# EAGLE design SilentStepStick-TMC2100_v13 (EAGLE 7.7.0)
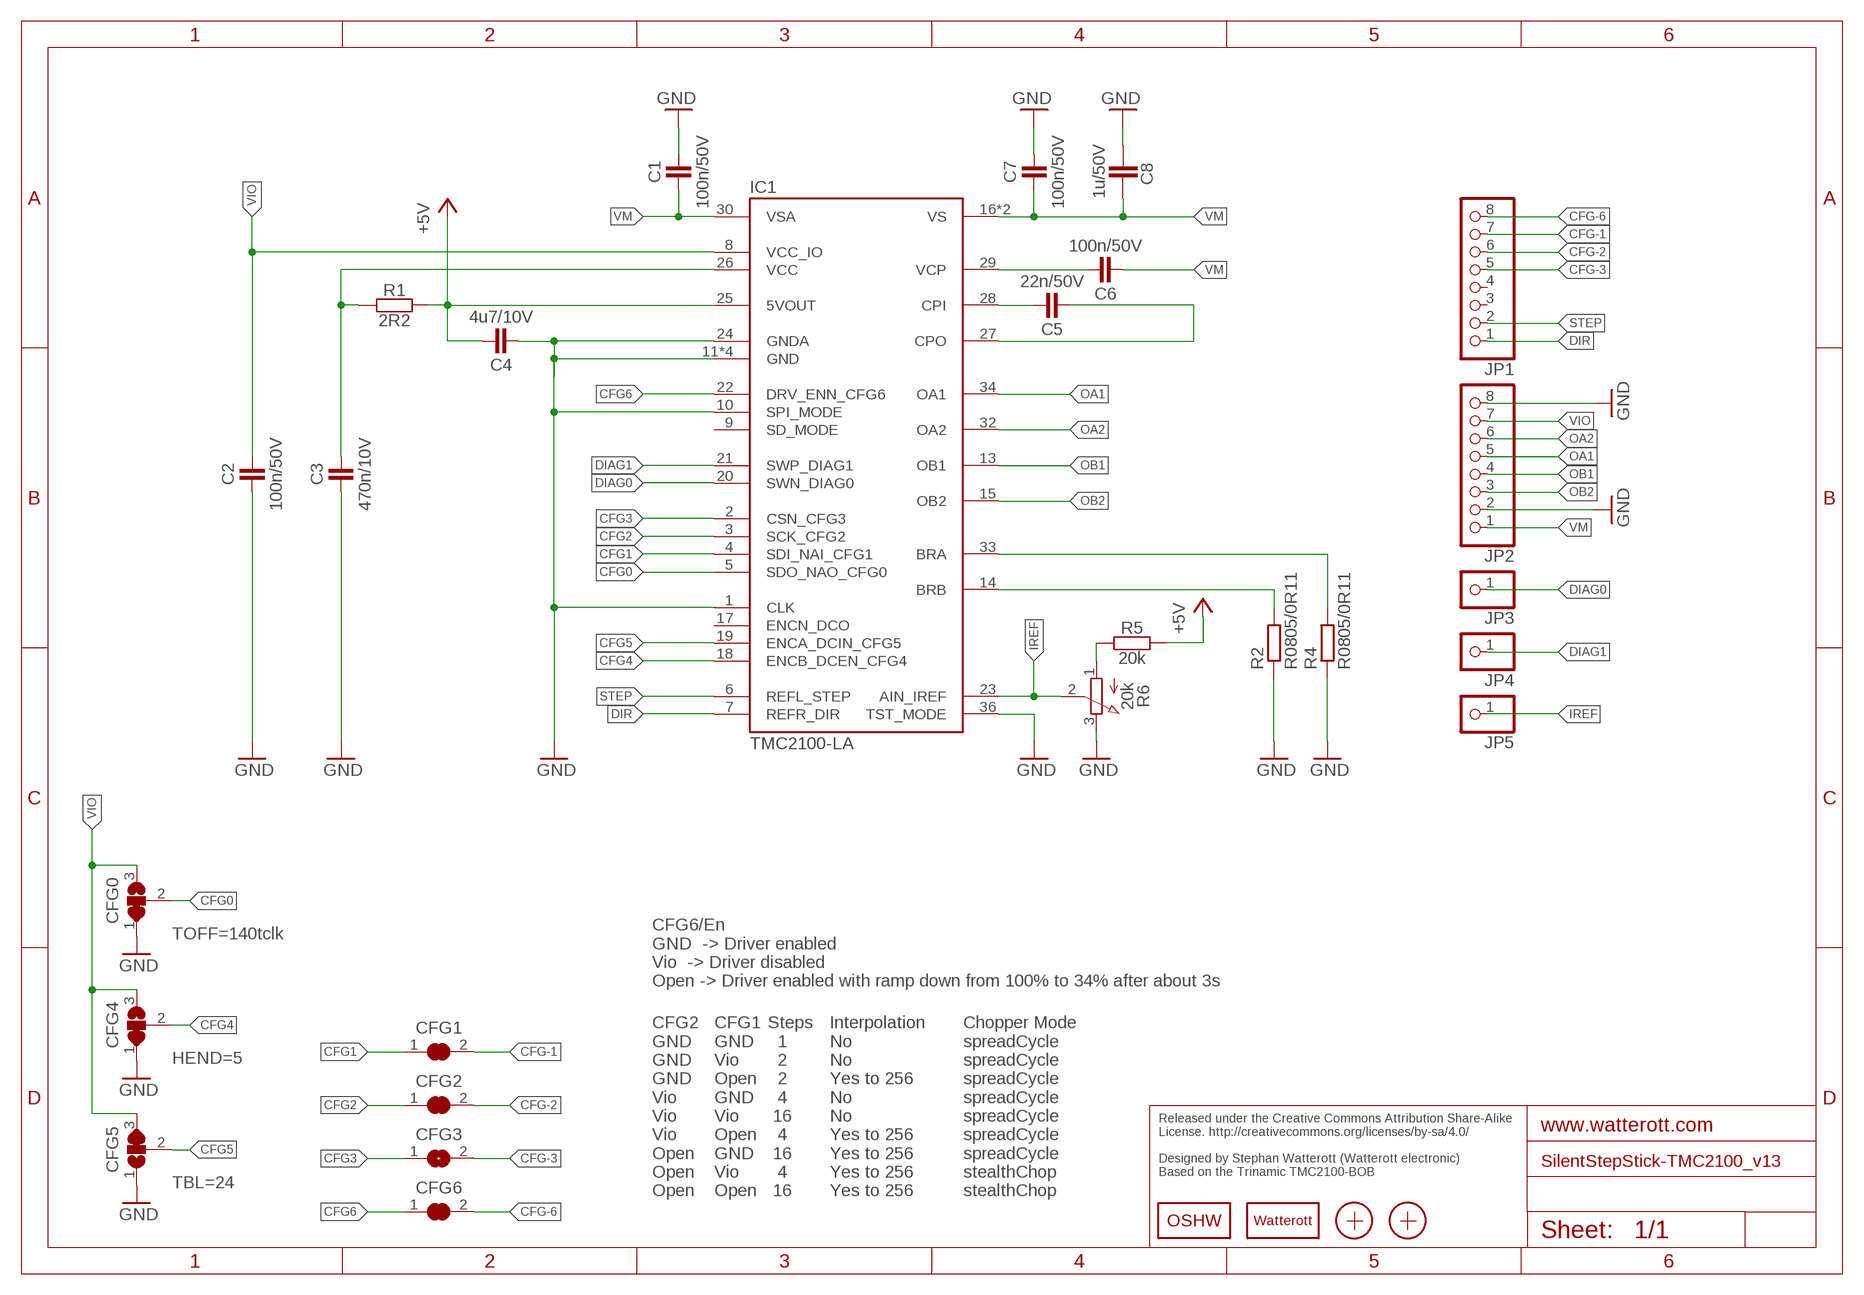
[diagram p0: schematic, sheet 1]

## Parts
C1  100n/50V  CAPACITOR-0402  [C0402]
C2  100n/50V  CAPACITOR-0402  [C0402]
C3  470n/10V  CAPACITOR-0402  [C0402]
C4  4u7/10V  CAPACITOR-0402  [C0402]
C5  22n/50V  CAPACITOR-0402  [C0402]
C6  100n/50V  CAPACITOR-0402  [C0402]
C7  100n/50V  CAPACITOR-0402  [C0402]
C8  1u/50V  C-EUC0603  [C0603]
CFG0  JUMPER3-0201  [JUMPER3-0201]
CFG1  JUMPER2-0201  [JUMPER2-0201]
CFG2  JUMPER2-0201  [JUMPER2-0201]
CFG3  JUMPER2-0201  [JUMPER2-0201]
CFG4  JUMPER3-0201  [JUMPER3-0201]
CFG5  JUMPER3-0201  [JUMPER3-0201]
CFG6  JUMPER2-0201  [JUMPER2-0201]
IC1  TMC2100-LA  TMC21X0-LA  [QFN36-PAD]
JP1  PINHD-1X08_2.54-S  [1X08-S]
JP2  PINHD-1X08_2.54-S  [1X08-S]
JP3  PINHD-1X1  [1X01]
JP4  PINHD-1X1  [1X01]
JP5  PINHD-1X1  [1X01]
LOGO1  OSHW_LOGOX0070  [OSHW_6X70]
LOGO2  LOGO-S_PLACE_M  [SPARK_TPLACE_M]
R1  2R2  RESISTOR-0402  [C0402]
R2  R0805/0R11  R-EU_M0805  [M0805]
R4  R0805/0R11  R-EU_M0805  [M0805]
R5  20k  RESISTOR-0402  [C0402]
R6  20k  POT-EVM3R  [POT_EVM3R]
X1  PASSER-07  [PASSER_07MM]
X2  PASSER-07  [PASSER_07MM]

## Nets
+5V: C4.2 IC1.25(5VOUT) R1.2 R5.2
BRA: IC1.33(BRA) R4.2
BRB: IC1.14(BRB) R2.2
CFG0: CFG0.2 IC1.5(SDO_NAO_CFG0)
CFG1: CFG1.1 IC1.4(SDI_NAI_CFG1)
CFG2: CFG2.1 IC1.3(SCK_CFG2)
CFG3: CFG3.1 IC1.2(CSN_CFG3)
CFG4: CFG4.2 IC1.18(ENCB_DCEN_CFG4)
CFG5: CFG5.2 IC1.19(ENCA_DCIN_CFG5)
CFG6: CFG6.1 IC1.22(DRV_ENN_CFG6)
CFG-1: CFG1.2 JP1.7
CFG-2: CFG2.2 JP1.6
CFG-3: CFG3.2 JP1.5
CFG-6: CFG6.2 JP1.8
CPI: C5.2 IC1.28(CPI)
CPO: C5.1 IC1.27(CPO)
DIAG0: IC1.20(SWN_DIAG0) JP3.1
DIAG1: IC1.21(SWP_DIAG1) JP4.1
DIR: IC1.7(REFR_DIR) JP1.1
GND: C1.2 C2.1 C3.1 C4.1 C7.2 C8.2 CFG0.1 CFG4.1 CFG5.1 IC1.1(CLK) IC1.10(SPI_MODE) IC1.11(GND) IC1.12(GND) IC1.24(GNDA) IC1.35(GND) IC1.36(TST_MODE) IC1.TP(GND) JP2.2 JP2.8 R2.1 R4.1 R6.3(E)
IREF: IC1.23(AIN_IREF) JP5.1 R6.2(S)
OA1: IC1.34(OA1) JP2.5
OA2: IC1.32(OA2) JP2.6
OB1: IC1.13(OB1) JP2.4
OB2: IC1.15(OB2) JP2.3
STEP: IC1.6(REFL_STEP) JP1.2
VCC: C3.2 IC1.26(VCC) R1.1
VCP: C6.2 IC1.29(VCP)
VIO: C2.2 CFG0.3 CFG4.3 CFG5.3 IC1.8(VCC_IO) JP2.7
VM: C1.1 C6.1 C7.1 C8.1 IC1.16(VS) IC1.30(VSA) IC1.31(VS) JP2.1
VREF1: R5.1 R6.1(A)
Unconnected: IC1.9(SD_MODE) IC1.17(ENCN_DCO) JP1.3 JP1.4

## Notes on the sheet
- CFG6/En
  GND  -> Driver enabled
  Vio  -> Driver disabled
  Open -> Driver enabled with ramp down from 100% to 34% after about 3s
- TOFF=140tclk
- CFG2
  GND
  GND
  GND
  Vio
  Vio
  Vio
  Open
  Open
  Open
- CFG1
  GND
  Vio
  Open
  GND
  Vio
  Open
  GND
  Vio
  Open
- Steps
    1
    2
    2
    4
   16
    4
   16
    4
   16
- Interpolation
  No
  No
  Yes to 256
  No
  No
  Yes to 256
  Yes to 256
  Yes to 256
  Yes to 256
- Chopper Mode
  spreadCycle
  spreadCycle
  spreadCycle
  spreadCycle
  spreadCycle
  spreadCycle
  spreadCycle
  stealthChop
  stealthChop
- HEND=5
- Released under the Creative Commons Attribution Share-Alike 
  License. http://creativecommons.org/licenses/by-sa/4.0/
  
  Designed by Stephan Watterott (Watterott electronic) 
  Based on the Trinamic TMC2100-BOB
- TBL=24

## Library data of the parts
C1-C7 = we-rcl:CAPACITOR: Capacitors ...2.2uF @ 6.3V -> 0402 ...4.7uF @ 6.3V -> 0603 ...10uF @ 16V -> 0805 ...22uF @ 25V -> 1206
C8 = rcl:C-EU: CAPACITOR, European symbol
CFG0 CFG4 CFG5 = we-rcl:JUMPER3: 3 Pin Jumpers
CFG1-CFG3 CFG6 = we-rcl:JUMPER2: 2 Pin Jumpers
IC1 = we-chip:TMC21X0: Trinamic TMC21x0 Stepper Motor Driver (5V...46V, 1.2A RMS, 256 microsteps) TMC2100 - CFG pins for configuration (standalone) TMC2130 - SPI for configuration
JP1 JP2 = pinhead-2:PINHD-1X08: PIN HEADER
JP3-JP5 = pinhead:PINHD-1X1: PIN HEADER
LOGO1 = we-symbol:OSHW_LOGO: Open-Source-Hardware Logo
LOGO2 = we-symbol:LOGO: Watterott electronic Logo
R1 R5 = we-rcl:RESISTOR: Resistors all kinds in 0402 and 0603
R2 R4 = rcl:R-EU_: RESISTOR, European symbol
R6 = we-rcl:POT: Potentiometer
X1 X2 = we-symbol:PASSER: Fiducial Markers

## Board
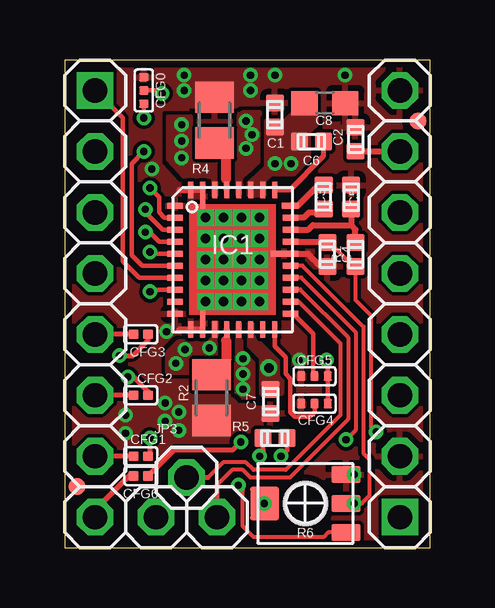
[diagram p1: board, top side]
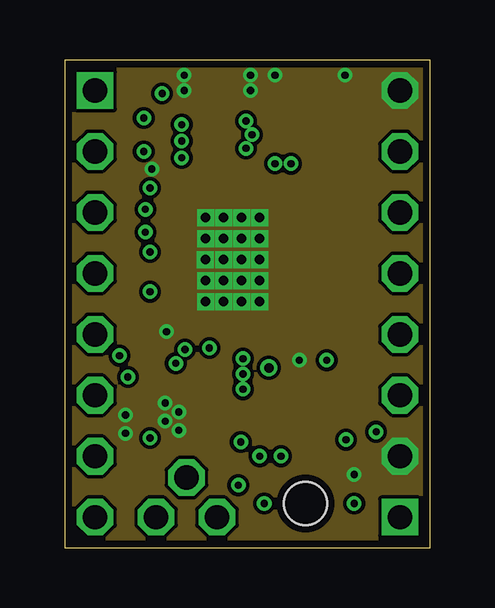
[diagram p2: board, inner layer Ground]
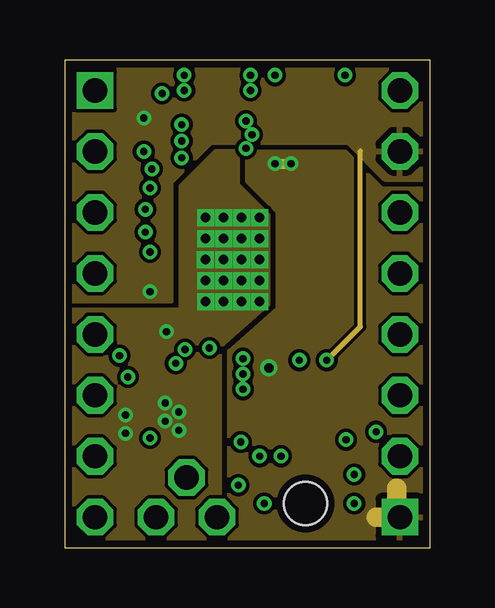
[diagram p3: board, inner layer Supply]
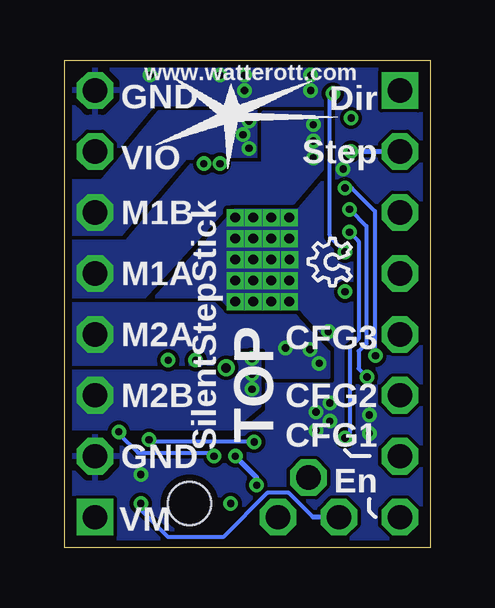
[diagram p4: board, bottom side, seen from below]

Size 15.24 x 20.32 mm. Coordinates in mm from the lower left corner, seen from the top.
Outline: 0,0 15.24,0 15.24,20.32 0,20.32 0,0
Copper layers (1+2*15+16): Top 0.035mm / dielectric 0.35mm / Ground 0.035mm / dielectric 0.76mm / Supply 0.035mm / dielectric 0.35mm / Bottom 0.035mm
Design rules "Default_WE_Euro *": minimum track width 0.15mm, minimum drill 0.25mm, track to track 0.15mm, track to pad 0.15mm, pad to pad 0.15mm, via to via 0.15mm, smd to smd 0mil, copper to edge 0.3mm, drill to drill 8mil, minimum pad ring 10mil, minimum via ring 6mil, stop-mask expansion 2mil, vias tented up to drill 0.5mm, thermal gap 10mil

### Footprints (pad centres in the part's own frame; a part is rotated, then mirrored left to right if it is on the bottom)
C0402 = smd 0.75 x 0.7: 1 0,0.5; 2 0,-0.5
C0603 = smd 1.1 x 1: 1 -0.85,0; 2 0.85,0
JUMPER3-0201 = smd 0.4 x 0.35: 1 0,0.55; 2 0,0; 3 0,-0.55
JUMPER2-0201 = smd 0.4 x 0.4: 1 0,0.3; 2 0,-0.3
QFN36-PAD = smd 0.7 x 0.26: 1 -2.4,2.25; 2 -2.4,1.75; 3 -2.4,1.25; 4 -2.4,0.75; 5 -2.4,0.25; 6 -2.4,-0.25; 7 -2.4,-0.75; 8 -2.4,-1.25; 9 -2.4,-1.75; 10 -2.4,-2.25; 19 2.4,-2.25; 20 2.4,-1.75; 21 2.4,-1.25; 22 2.4,-0.75; 23 2.4,-0.25; 25 2.4,0.75; 26 2.4,1.25; 27 2.4,1.75; 28 2.4,2.25 | smd 0.26 x 0.7: 11 -1.75,-2.9; 13 -0.75,-2.9; 14 -0.25,-2.9; 15 0.25,-2.9; 16 0.75,-2.9; 17 1.25,-2.9; 18 1.75,-2.9; 29 1.75,2.9; 30 1.25,2.9; 31 0.75,2.9; 32 0.25,2.9; 33 -0.25,2.9; 34 -0.75,2.9; 36 -1.75,2.9 | smd 0.26 x 1.2: 12 -1.25,-2.65; 35 -1.25,2.65 | smd 1.2 x 0.26: 24 2.15,0.25 | smd 0.6 x 0.6: TP 0,0
1X08-S = drill 1.016 square: 1 -8.89,0 | drill 1.016 octagon: 2 -6.35,0; 3 -3.81,0; 4 -1.27,0; 5 1.27,0; 6 3.81,0; 7 6.35,0; 8 8.89,0
1X01 = drill 1.016 octagon: 1 0,0
M0805 = smd 1.3 x 1.6: 1 -0.95,0; 2 0.95,0
POT_EVM3R = smd 0.7 x 1.2: 1 -1.2,-1.7; 2 0,-1.7; 3 1.2,-1.7 | smd 1.4 x 1.2: MOUNT 0,1.7 | hole 1.8: 0,0
PASSER_07MM = smd 0.7 x 0.7: X 0,0

### Placement (x,y rotation side)
C1  8.76,18.03 180 top
C2  12.12,17.02 0 top
C3  11.94,14.61 0 top
C4  10.95,12.22 180 top
C5  10.79,14.61 180 top
C6  10.29,16.92 90 top
C7  8.57,6.1 0 top
C8  10.84,18.53 0 top
CFG0  3.3,19.05 0 top
CFG1  3.17,3.81 270 top
CFG2  3.17,6.35 270 top
CFG3  3.17,8.89 270 top
CFG4  10.41,6 90 top
CFG5  10.41,7.14 90 top
CFG6  3.17,2.98 270 top
IC1  7,12 0 top
JP1  1.27,10.16 270 top
JP2  13.97,10.16 90 top
JP3  5.08,2.92 0 top
JP4  6.35,1.27 0 top
JP5  3.81,1.27 0 top
LOGO1  3.3,10.92 90 bottom
LOGO2  8.26,18.03 0 bottom
R1  12.12,12.22 0 top
R2  6.12,6.25 90 top
R4  6.25,17.81 270 top
R5  8.76,4.57 90 top
R6  10.03,1.84 90 top
X1  0.51,2.54 0 top
X2  14.73,17.78 0 top

### Tracks (layer width: path | path; a pad name or v marks a point on that pad's centre or on a via)
+5V  (via drill 0.3 pad 0.41)
  Top 0.16: v12.98,4.83 12.78,5.03 12.78,9.67 12.12,10.33 R1.2 12.03,11.72 11.05,12.7 10.98,12.7 C4.2
  Top 0.2: R5.2 9.26,4.06 v9.02,3.81
  Top 0.25: IC1.25 10.93,12.75 C4.2
  Bottom 0.16: v9.02,3.81 9.08,3.87 9.1,3.87 9.17,3.95 12.18,3.95 12.98,4.75 v12.98,4.83
BRA
  Top 0.254: 6.5,16.61 R4.2 | IC1.33 6.75,15.34 6.73,15.37
  Top 0.406: 6.73,15.37 6.73,16.38 R4.2
BRB
  Top 0.16: 6.73,7.81 R2.2
  Top 0.254: IC1.14 6.75,8.66 6.73,8.64
  Top 0.406: 6.73,8.64 6.73,7.81
CFG0  (via drill 0.3)
  Top 0.18: v4.06,18.92 3.94,19.05 CFG0.2 | IC1.5 3.62,12.25 v3.56,12.32
  Bottom 0.16: 4.19,13.02 4.19,18.8 v4.06,18.92
  Bottom 0.17: 4.19,13.02 4.19,12.95 v3.56,12.32
CFG1  (via drill 0.3)
  Top 0.18: IC1.4 3.95,12.75 3.56,13.14 v3.37,13.14 | 3.56,3.89 CFG1.1
  Top 0.2: v3.56,4.57 3.56,3.89
  Bottom 0.16: v3.56,4.57 3.37,4.76 3.37,8.32 2.98,8.7 2.98,12.76 v3.37,13.14
CFG2  (via drill 0.3)
  Top 0.18: IC1.3 4.08,13.25 3.37,13.97 v3.37,14.1
  Top 0.2: CFG2.1 3.48,6.53 2.89,7.11 v2.64,7.11
  Bottom 0.16: v2.64,7.11 v2.63,7.11 2.99,7.46 2.99,8.19 2.67,8.51 2.67,13.4 v3.37,14.1
CFG3  (via drill 0.3)
  Top 0.18: IC1.2 4.16,13.75 3.94,13.97 3.94,14.61 v3.56,14.99
  Top 0.2: v2.29,8 2.86,8 3.48,8.62 CFG3.1
  Bottom 0.16: v2.29,8 2.29,8.04 2.31,8.06 2.31,14.03 3.27,14.99 v3.56,14.99
CFG4
  Top 0.18: IC1.18 8.75,8.39 9.21,7.94 9.21,7.24 9.4,7.05 9.4,5.65 9.59,5.46 10.22,5.46 10.41,5.65 CFG4.2
CFG5
  Top 0.18: IC1.19 9.55,9.75 9.55,9.72 10.35,8.92 10.35,7.21 CFG5.2
CFG6  (via drill 0.3 pad 0.41)
  Top 0.16: v11.72,4.5 12.13,4.9 12.13,8.98 9.86,11.25 IC1.22
  Top 0.2: v7.34,4.41 7,4.06 4.55,4.06 CFG6.1
  Bottom 0.16: v7.34,4.41 11.63,4.41 v11.72,4.5
CFG-1
  Top 0.2: CFG1.2 JP1.7
CFG-2
  Top 0.2: CFG2.2 JP1.6
CFG-3
  Top 0.2: CFG3.2 JP1.5
CFG-6
  Top 0.18: JP1.8 1.33,1.33
  Top 0.2: 1.33,1.33 1.33,1.65 2.67,2.98 CFG6.2
CPI
  Top 0.18: 10.63,14.99 10.68,14.99
  Top 0.25: 10.63,14.99 10.45,14.99 9.71,14.25 IC1.28 | 10.68,14.99 C5.2
CPO
  Top 0.25: C5.1 10.66,13.97 10.19,13.97 9.97,13.75 IC1.27
DIAG0
  Top 0.16: 5.97,2.92 6.6,3.56 7.56,3.56 7.87,3.24 9.21,3.24 11.49,5.52 11.49,8.51 9.75,10.25 IC1.20
  Top 0.2: 5.97,2.92 JP3.1
DIAG1
  Top 0.16: 6.35,2.6 6.99,3.24 7.43,3.24 7.75,2.92 9.37,2.92 11.81,5.36 11.81,8.76 9.82,10.75 IC1.21
  Top 0.2: 6.35,2.6 JP4.1
DIR
  Top 0.18: JP1.1 2.41,17.91 2.41,11.94 3.1,11.25 IC1.7
GND  (via drill 0.3, 0.4, 0.4 pad 0.41)
  Top 0.18: 5.75,9.12 5.73,9.1
  Top 0.2: IC1.35 5.75,14.9 | IC1.TP v8.13,12
  Top 0.25: 5.73,9.1 IC1.11 4.78,9.1 | C4.1 10.93,11.75 10.64,11.75 10.13,12.25 IC1.24 8.13,12.25 v8.13,12 | 5.75,14.9 IC1.36 4.78,14.9
  other vias: 4.98,19.68 4.98,19.05 7.75,19.05 4.76,5.65 4.19,6.03 4.19,5.27 4.25,9 5.88,13.75 6.63,13.75 7.38,13.75 8.13,13.75 5.88,12.88 6.63,12.88 7.38,12.88 8.13,12.88 6.63,12 7.38,12 6.63,11.12 5.88,11.12 7.38,11.12 8.13,11.12 5.88,10.25 6.63,10.25 7.38,10.25 7.75,19.68 8.76,19.68 3.63,15.78 8.13,10.25 4.76,4.89 11.68,19.68 2.54,5.52 2.54,4.76 12.06,3.05 9.78,7.81 5.87,12
  pour Top (rank 6): 0,20.32 15.24,20.32 15.24,0 0,0
  pour Ground (no thermals): 0,20.32 15.24,20.32 15.24,0 0,0
  pour Bottom (rank 6): 0,20.32 15.24,20.32 15.24,0 0,0
  pour Top (no thermals): 5.08,20 5.08,18.41 7.14,18.41 7.46,18.73 7.46,20
  pour Top (no thermals): 5.02,4.25 8.19,4.25 8.2,5.82 7.33,5.82 6.99,6.16 5.02,6.16
  pour Supply: 6.29,16.51 4.83,15.05 4.83,9.91 0,9.91 0,0 6.48,0 6.48,8.38 8.51,10.16 8.51,13.84 7.24,15.11 7.24,16.51
IREF  (via drill 0.3)
  Top 0.16: 11.77,1.88 R6.2 | 11.67,1.91 R6.2 | 11.8,1.84 R6.2 | 9.15,11.75 IC1.23 | IC1.23 9.9,11.75 12.45,9.21 12.45,3.94 12.7,3.68 12.7,2.16 12.38,1.84 | IC1.23 9.46,11.75
  Top 0.18: 11.8,1.84 v12.06,1.84 12.38,1.84
  Bottom 0.16: 4.89,1.27 5.91,2.29 6.79,2.29 8.64,0.45 10.92,0.45 12.06,1.59 v12.06,1.84
  Bottom 0.2: JP5.1 4.89,1.27
MOUNT  (via drill 0.3)
  other vias: 8.32,1.84
OA1  (via drill 0.3)
  other vias: 4.88,17.63 4.88,16.24 4.88,16.94
  pour Top (rank 2, no thermals): 6.31,14.69 6.31,16.12 5.25,16.12 5.25,17.94 4.31,17.94 4.31,16.19 4.97,15.47 6.19,15.47 6.19,14.69
  pour Bottom (rank 3, no thermals): 12.25,10.12 15.25,10.12 15.25,12.75 12.62,12.75 9.88,16 6.94,16 6.94,18.12 4.25,18.12 4.25,16.12 5.75,14.38 8.37,14.38
OA2  (via drill 0.3)
  other vias: 7.81,17.21 7.56,16.64 7.56,17.78
  pour Top (rank 3, no thermals): 8.12,15.83 8.12,18.12 7.25,18.12 7.25,16.12 7.19,16.13 7.19,14.69 7.3,14.73 7.3,15.05
  pour Bottom (rank 4, no thermals): 15.25,13 12.62,13 9.88,16.12 7.12,16.12 7.12,18.13 11.31,18.13 13.69,15.25 15.25,15.25
OB1  (via drill 0.3)
  other vias: 5.02,8.26 6.03,8.32 4.64,7.68
  pour Top (rank 2, no thermals): 6.35,7.3 6.35,9.37 6.19,9.37 6.19,8.73 6.03,8.57 4.76,8.57 4.29,8.1 4.29,7.3
  pour Bottom (rank 2, no thermals): 15.25,10.12 15.19,7.62 8.4,7.62 8.34,8.12 7,8.12 7,7.14 4.25,7.14 4.25,8.12 5.62,9.62 8.5,9.62 9,10.12
OB2  (via drill 0.3)
  other vias: 7.43,7.87 7.43,7.24 7.43,6.6
  pour Top (rank 3, no thermals): 8,6.28 8,7.94 7.3,8.64 7.3,9.31 7.2,9.31 7.2,8.6 7.05,8.45 7.01,6.28
  pour Bottom (no thermals): 15.25,7.31 15.25,5 8.25,5 7.12,5.94 7.12,8.03 7.97,8.03 arc11 7.99,7.31
STEP  (via drill 0.3)
  Top 0.18: v3.3,16.51 2.79,16 2.79,12.19 3.24,11.75 IC1.6
  Bottom 0.2: v3.3,16.51 JP1.2
VCC
  Top 0.25: IC1.26 10.16,13.25 10.35,13.44 11.94,13.44 | C3.2 11.94,13.44 | 11.94,13.44 | R1.1 12.12,13.26 11.94,13.44
VCP
  Top 0.2: C6.2 10.79,16.31 9.38,14.9 IC1.29
VIO  (via drill 0.3)
  Top 0.18: IC1.8 3.64,10.75 v3.56,10.67 | CFG0.3 v3.3,17.91 | CFG4.3 CFG5.3 10.96,7.77 v10.92,7.81
  Top 0.25: C2.2 JP2.7
  Supply 0.18: v3.56,10.67 3.43,10.54
  Supply 0.2: 12.32,16.53 12.32,9.21 v10.92,7.81
  pour Supply: 15.24,15.36 15.24,20.32 0,20.32 0,10.29 4.45,10.29 4.45,15.24 6.1,16.89 11.81,16.88 13.34,15.36
VM  (via drill 0.3, 0.4)
  Supply 0.406: v8.76,16 v9.44,16
  Supply 0.813: 13.84,1.4 13.84,2.48 | 13.84,1.27 12.99,1.27
  other vias: 8.51,7.49
  pour Top (no thermals): 7.69,14.69 7.69,15.19 7.76,15.25 8.41,15.88 8.41,17.78 9.21,17.78 9.53,18.1 10.32,18.1 10.48,17.94 10.48,17.62 10.16,17.3 10.16,16.03 9.68,15.56 8.57,15.56 8.3,15.28 8.3,14.69
  pour Top (no thermals): 7.69,9.31 7.69,8.43 8.18,7.94 8.18,6.44 9.06,6.44 9.06,7.56 7.81,8.81 7.81,9.31
  pour Supply: 15.24,0 6.86,0 6.86,8.19 8.89,9.97 8.89,13.97 7.62,15.24 7.62,16.51 11.68,16.51 13.21,14.99 15.24,14.99
VREF1  (via drill 0.3)
  Top 0.16: R6.1 11.43,0.64 | 11.43,0.64 10.99,0.64 10.79,0.45 7.87,0.45 7.43,0.89 7.43,2.41 v7.24,2.6 | 11.49,0.7 11.43,0.64
  Top 0.2: R5.1 8.26,3.94 v8.13,3.81
  Bottom 0.2: v7.24,2.6 7.24,2.92 v8.13,3.81

### Text on the board
bPlace: www.watterott.com | Dir | GND | Step | VIO | M1B | M1A | CFG3 | M2A | CFG2 | M2B | CFG1 | TOP | SilentStepStick | En | GND | VM
Document: Dir | GND | Step | Vio - 3.3-5V | nc | Motor Coil 1-B | nc | Motor Coil 1-A | CFG3 | Motor Coil 2-A | CFG2 | Motor Coil 2-B | CFG1 | GND | En/CFG6 | Vm | VRef | DIAG0 | DIAG1
Reference: Silkscreen: 22 bPlace